# EAGLE design tetrabyte-slim (EAGLE 7.7.0)
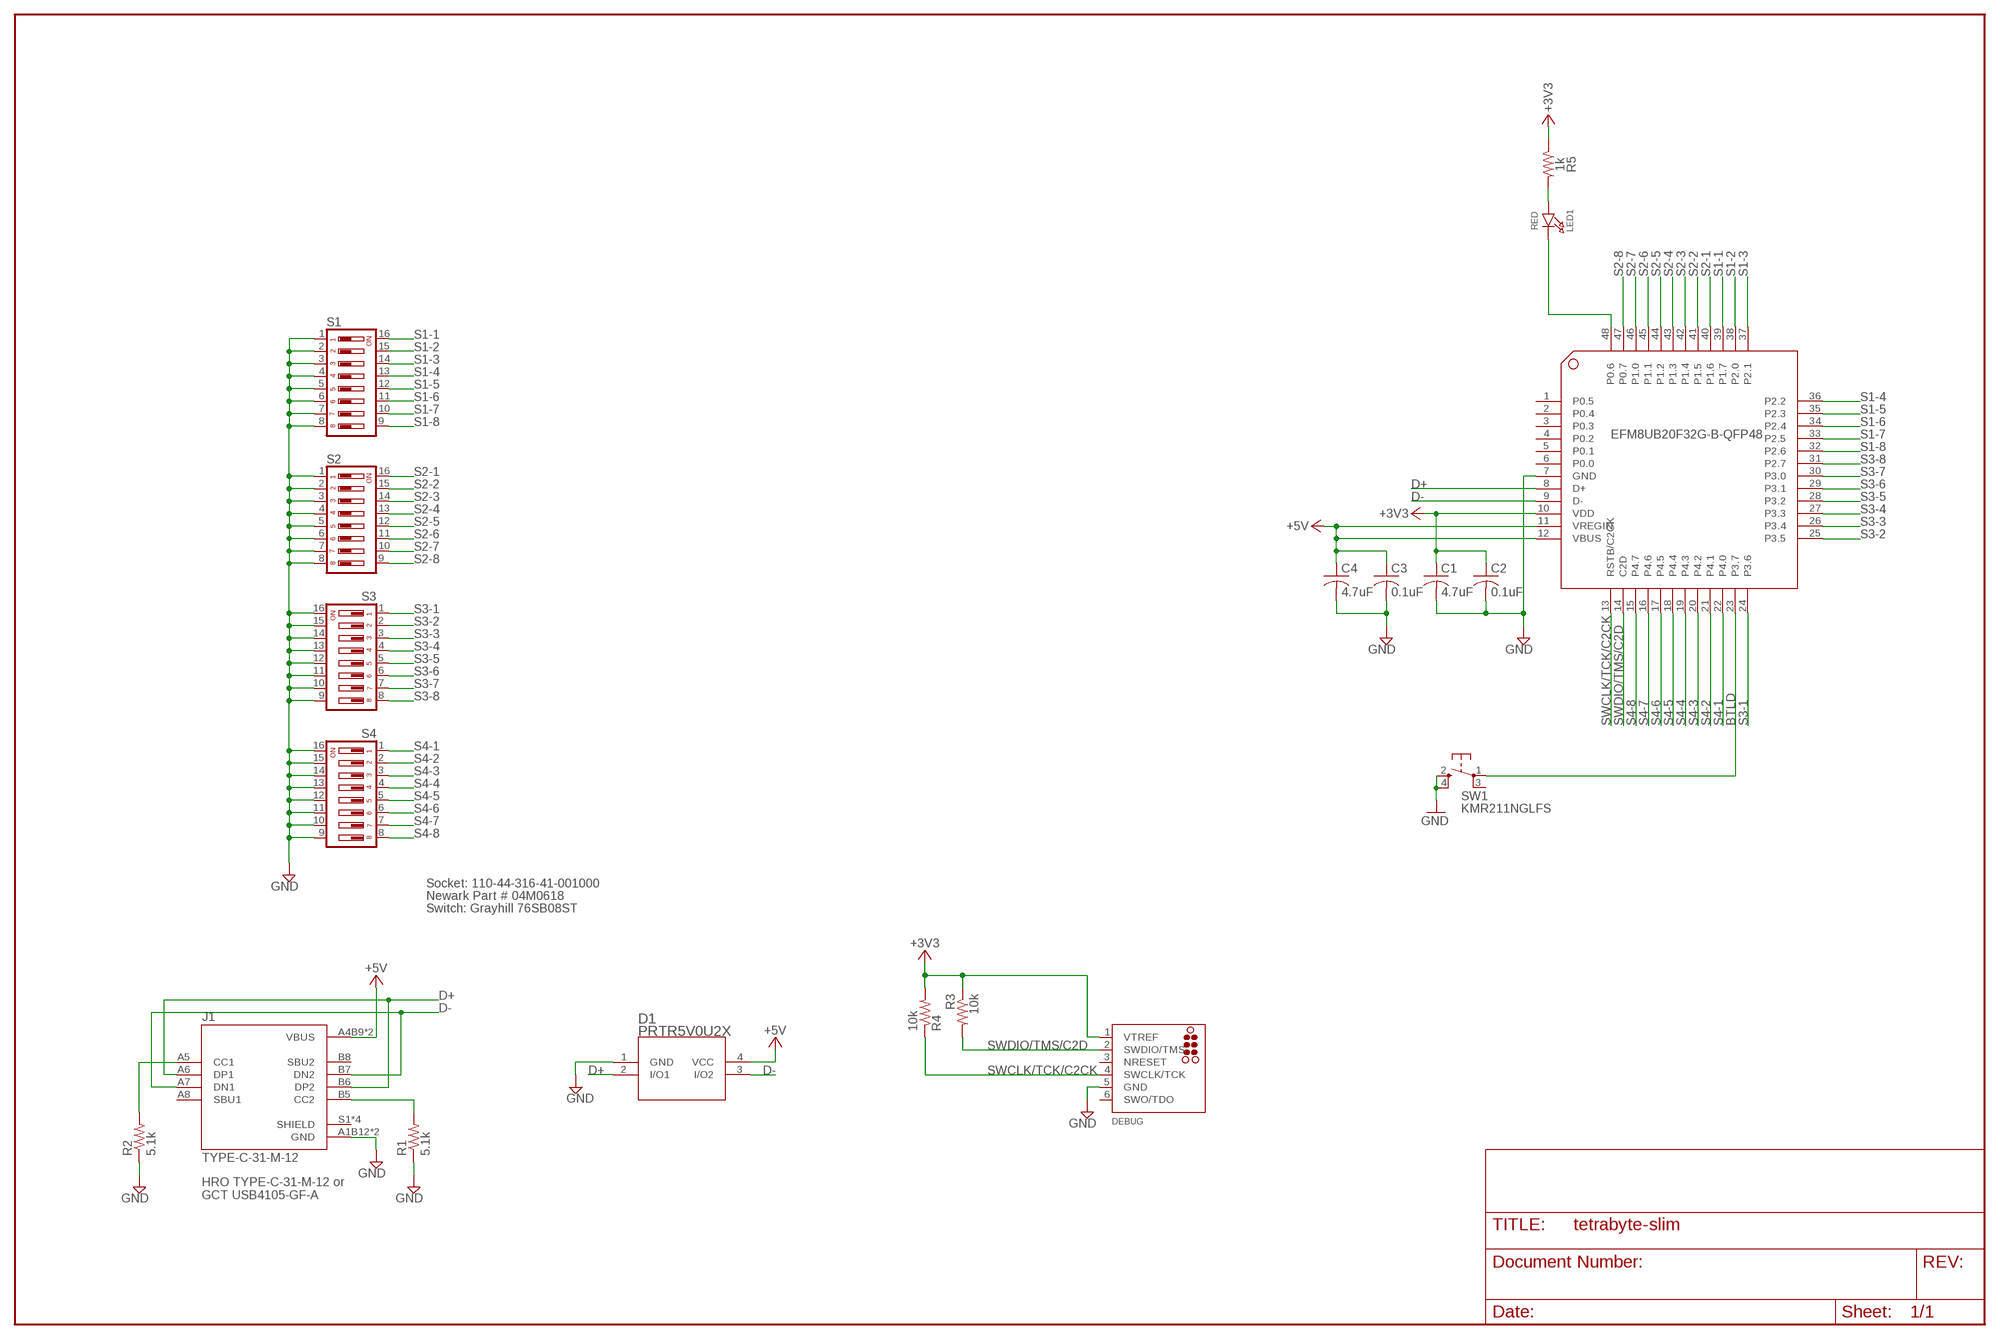
[diagram p0: schematic, sheet 1]

## Parts
C1  4.7uF  C-USC0603K  [C0603K]
C2  0.1uF  C-USC0603K  [C0603K]
C3  0.1uF  C-USC0603K  [C0603K]
C4  4.7uF  C-USC0603K  [C0603K]
D1  PRTR5V0U2X  [SOT143B]
DEBUG  TC2030-CTX-SWD  [TC2030-MCP-NL]
J1  TYPE-C-31-M-12  [HRO_TYPE-C-31-M-12]
LED1  RED  LED0805_NOOUTLINE  [CHIPLED_0805_NOOUTLINE]
R1  5.1k  R-US_R0603  [R0603]
R2  5.1k  R-US_R0603  [R0603]
R3  10k  R-US_R0603  [R0603]
R4  10k  R-US_R0603  [R0603]
R5  1k  R-US_R0603  [R0603]
S1  DS08  [DS-08]
S2  DS08  [DS-08]
S3  DS08  [DS-08]
S4  DS08  [DS-08]
SW1  KMR211NGLFS  SPST_TACT-KMR2  [KMR2]
U1  EFM8UB20F64G-B-QFP48  [EFM8UB2-QFP48]

## Nets
+3V3: C1.1 C2.1 DEBUG.1(VTREF) R3.1 R4.2 R5.1 U1.10(VDD)
+5V: C3.1 C4.1 D1.4(VCC) J1.A4B9(VBUS) J1.B4A9(VBUS) U1.11(VREGIN) U1.12(VBUS)
BTLD: SW1.1(P) U1.23(P3.7)
D+: D1.2(I/O1) J1.A6(DP1) J1.B6(DP2) U1.8(D+)
D-: D1.3(I/O2) J1.A7(DN1) J1.B7(DN2) U1.9(D-)
GND: C1.2 C2.2 C3.2 C4.2 D1.1(GND) DEBUG.5(GND) J1.A1B12(GND) J1.B1A12(GND) R1.1 R2.1 S1.1 S1.2 S1.3 S1.4 S1.5 S1.6 S1.7 S1.8 S2.1 S2.2 S2.3 S2.4 S2.5 S2.6 S2.7 S2.8 S3.9 S3.10 S3.11 S3.12 S3.13 S3.14 S3.15 S3.16 S4.9 S4.10 S4.11 S4.12 S4.13 S4.14 S4.15 S4.16 SW1.2(S) SW1.4(S1) U1.7(GND)
N$3: LED1.A R5.2
N$19: LED1.C U1.48(P0.6)
N$20: J1.B5(CC2) R1.2
N$21: J1.A5(CC1) R2.2
S1-1: S1.16 U1.39(P1.7)
S1-2: S1.15 U1.38(P2.0)
S1-3: S1.14 U1.37(P2.1)
S1-4: S1.13 U1.36(P2.2)
S1-5: S1.12 U1.35(P2.3)
S1-6: S1.11 U1.34(P2.4)
S1-7: S1.10 U1.33(P2.5)
S1-8: S1.9 U1.32(P2.6)
S2-1: S2.16 U1.40(P1.6)
S2-2: S2.15 U1.41(P1.5)
S2-3: S2.14 U1.42(P1.4)
S2-4: S2.13 U1.43(P1.3)
S2-5: S2.12 U1.44(P1.2)
S2-6: S2.11 U1.45(P1.1)
S2-7: S2.10 U1.46(P1.0)
S2-8: S2.9 U1.47(P0.7)
S3-1: S3.1 U1.24(P3.6)
S3-2: S3.2 U1.25(P3.5)
S3-3: S3.3 U1.26(P3.4)
S3-4: S3.4 U1.27(P3.3)
S3-5: S3.5 U1.28(P3.2)
S3-6: S3.6 U1.29(P3.1)
S3-7: S3.7 U1.30(P3.0)
S3-8: S3.8 U1.31(P2.7)
S4-1: S4.1 U1.22(P4.0)
S4-2: S4.2 U1.21(P4.1)
S4-3: S4.3 U1.20(P4.2)
S4-4: S4.4 U1.19(P4.3)
S4-5: S4.5 U1.18(P4.4)
S4-6: S4.6 U1.17(P4.5)
S4-7: S4.7 U1.16(P4.6)
S4-8: S4.8 U1.15(P4.7)
SWCLK/TCK/C2CK: DEBUG.4(SWCLK/TCK) R4.1 U1.13(RSTB/C2CK)
SWDIO/TMS/C2D: DEBUG.2(SWDIO/TMS) R3.2 U1.14(C2D)
Unconnected: DEBUG.6(SWO/TDO) J1.A8(SBU1) J1.B8(SBU2) J1.S1(SHIELD) J1.S2(SHIELD) J1.S3(SHIELD) J1.S4(SHIELD) SW1.3(P1) U1.1(P0.5) U1.2(P0.4) U1.3(P0.3) U1.4(P0.2) U1.5(P0.1) U1.6(P0.0)

## Notes on the sheet
- EFM8UB20F32G-B-QFP48
- Socket: 110-44-316-41-001000
- Newark Part # 04M0618
- Switch: Grayhill 76SB08ST
- HRO TYPE-C-31-M-12 or
  GCT USB4105-GF-A

## Power pins joined to a net without a drawn wire
NRESET: DEBUG.3(NRESET)

## Library data of the parts
C1-C4 = rcl:C-US: CAPACITOR, American symbol
D1 = Nexperia_PRTR5V0U2X,215:PRTR5V0U2X; MANUFACTURER_PART_NUMBER: PRTR5V0U2X; VENDOR: NXP
DEBUG = tag-connect:TC2030-CTX-SWD
J1 = TYPE-C-31-M-12-OSHPARK:TYPE-C-31-M-12: USB Connectors 24 Receptacle 1 8.94*7.3mm RoHS; AVAILABILITY: Unavailable; DESCRIPTION: USB Connectors 24 Receptacle 1 8.94*7.3mm RoHS; MF: HRO Electronics Co., Ltd.; MP: TYPE-C-31-M-12; PACKAGE: Package; PRICE: None
LED1 = microbuilder:LED: LED 0603 - 0603 Surface Mount Package 2mA: Green LED - Low Power (3.9mcd, 2ma, 1.7Vf) - Digikey: 475-2709-2-ND Orange LED - Low Power (9.8mcd, 2ma, 1.8Vf) - Digikey: 475-1194-2-ND Red LED - Low Power (5mcd, 2ma, 1.8Vf) - Digikey: 475-1195-2-ND Yellow LED - Low Power (7mcd, 2ma, 1.8Vf) - Digikey: 475-1196-2-ND 5mA: Blue LED - Low Power (17mcd, 5ma, 2.9Vf) - Digikey: LNJ937W8CRACT-ND 0805 - 0805 Surface Mount Package 2mA: Red LED (8.8mcd, 2mA, 1.8Vf, Clear) - Low Power [Digikey: 475-2510-1-ND] Green LED (5mcd, 2mA, 1.8Vf, Clear) - Low Power [Digikey: 475-2730-1-ND] Yellow LED (11.3mcd, 2mA, 1.8Vf, Clear) - Low Power [Digikey: 475-2555-1-ND] 20mA: Red LED (104mcd, 20mA, Diffused) - LS R976 [Digikey: 475-1278-6-ND] Red LED (12mcd, 20mA, 2.0Vf, Clear) - APT2012EC [Digikey: 754-1128-1-ND] Green LED (15mcd, 20mA, 2.2Vf, Clear) - APT2012GC [Digikey: 754-1131-1-ND] Orange LED (160mcd, 20mA, 2.1Vf, Clear) - APT2012SECK [Digikey: 754-1130-1-ND] 1206 - 1206 Surface Mount Package Green LED (26mcd, 20mA, Diffused) - LG N971 [Digikey: 475-1407-6-ND] Red LED (15mcd, 20mA, Diffused) - LH N974 [Digikey: 475-1416-6-ND] Cree - Cree High-Power Surface Mount LEDs XPEBWT-L1-0000-00D50 - White 111lm 350mA 2.9Vf 6200K 110° XTEAWT-00-0000-00000LEE3 - White 114lm 350mA 2.85Vf 5000K 115° Everlight - Everlight 45-21 Series Surface Mount LEDs 45-21/QK2C-B2832AC2CB2/2T - Warm White 2000mcd 20mA 3.25Vf 3050K 120° 45-21/LK2C-B38452C4CB2/2T - Nuetral White 2000mcd 20mA 3.25Vf 4150K 120° 45-21/LK2C-B50634C6CB2/2T - Cold White 2200mcd 20mA 3.25Vf 5650K 120° PLCC2 Reverse Mount LS T77K-J1L2-1-0-2-R18-Z - Red 11.25mcd 2mA 1.8Vf 630nm 120° LO T77K-L1M2-24-Z - Orange 19.6mcd 2mA 1.8Vf 606nm 120° LY T77K-K2M1-26-Z - Yellow 15.7mcd 2mA 1.8Vf 587nm 120°
R1-R5 = rcl:R-US_: RESISTOR, American symbol
S1-S4 = switch-dil:DS08: DIL/CODE SWITCH; MPN: DS08; OC_FARNELL: unknown; OC_NEWARK: 73J0071
SW1 = adafruit:SPST_TACT: SMT 6mm switch, EVQQ2 series http://www.ladyada.net/library/eagle
U1 = Glen-EFM8UB2:EFM8UB20F64G-B-QFP48

## Board
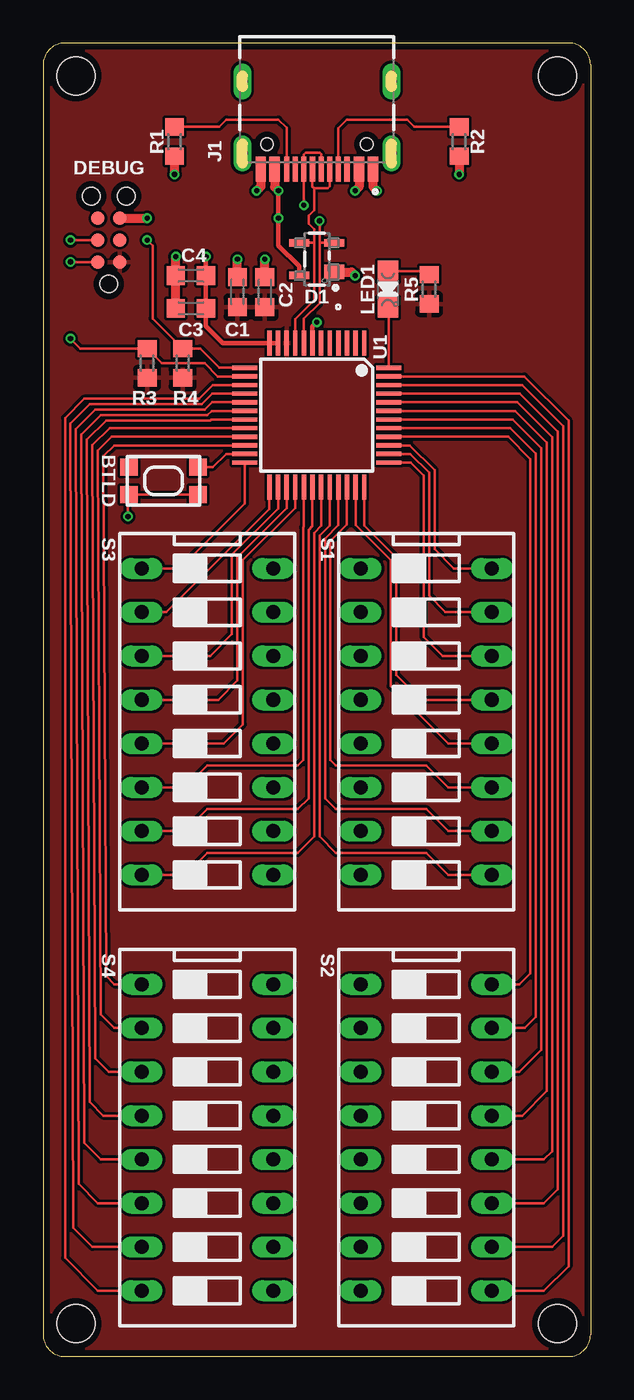
[diagram p1: board, top side]
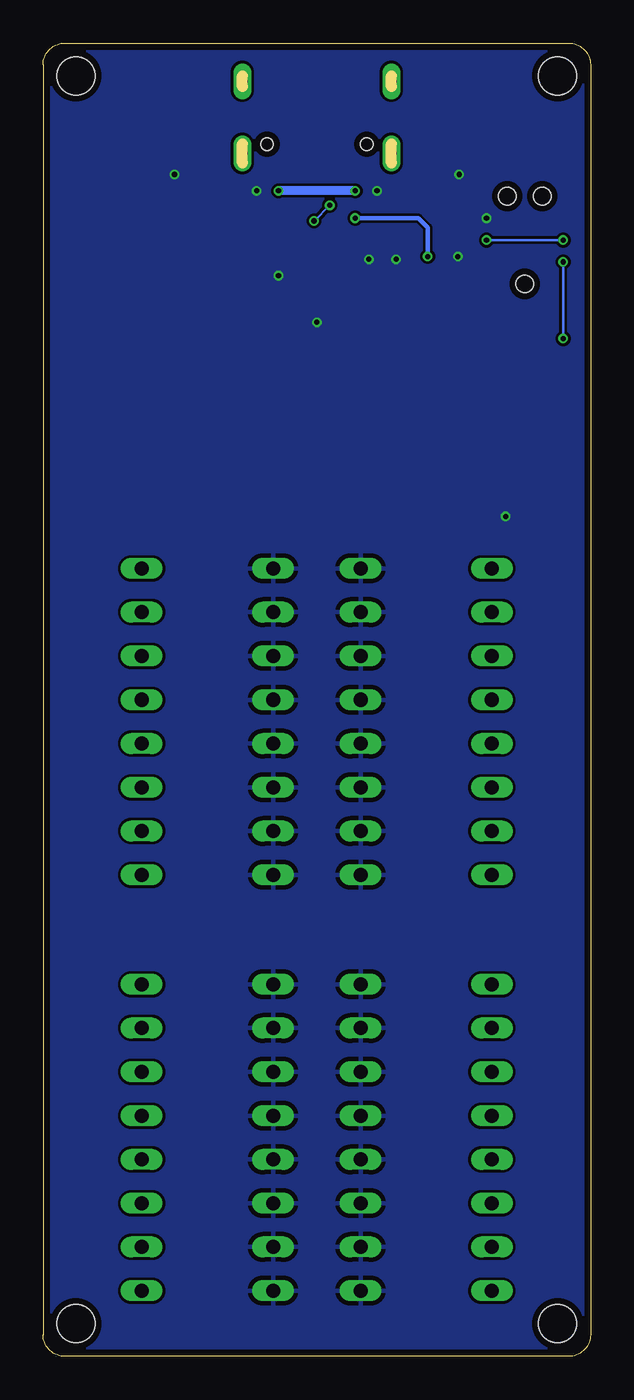
[diagram p2: board, bottom side, seen from below]

Size 31.75 x 76.2 mm. Coordinates in mm from the lower left corner, seen from the top.
Outline: 30.48,0 arc90 31.75,1.27 31.75,74.93 arc90 30.48,76.2 1.27,76.2 arc90 0,74.93 0,1.27 arc90 1.27,0 30.48,0
Copper layers (1*16): Top 0.035559375mm / dielectric 1.6mm / Bottom 0.035559375mm
Design rules "oshpark-2layer-2018": minimum track width 6mil, minimum drill 10mil, track to track 6mil, track to pad 6mil, pad to pad 6mil, via to via 6mil, smd to smd 6mil, copper to edge 15mil, drill to drill 6mil, minimum pad ring 5mil, minimum via ring 5mil, stop-mask expansion 2.5mil, vias tented up to drill 0mil, thermal gap 10mil
Holes 2.2 mm at 1.91,74.3 29.84,74.3 1.91,1.91 29.84,1.91

### Footprints (pad centres in the part's own frame; a part is rotated, then mirrored left to right if it is on the bottom)
C0603K = smd 1.05 x 1.08: 1 -0.875,0; 2 0.875,0
SOT143B = smd 0.838 x 1.168: 1 -0.747,-1.016 | smd 0.432 x 1.168: 2 0.95,-1.016; 3 0.95,1.016; 4 -0.95,1.016
TC2030-MCP-NL = smd 0.787 x 0.787: 1 1.27,-0.635; 2 1.27,0.635; 3 2.54,-0.635; 4 2.54,0.635; 5 3.81,-0.635; 6 3.81,0.635 | hole 0.991: 0,0; 5.08,-1.016; 5.08,1.016
HRO_TYPE-C-31-M-12 = smd 0.6 x 1.45: A1B12 -3.25,5.095; A4B9 -2.45,5.095; B1A12 3.25,5.095; B4A9 2.45,5.095 | smd 0.3 x 1.45: A5 -1.25,5.095; A6 -0.25,5.095; A7 0.25,5.095; A8 1.25,5.095; B5 1.75,5.095; B6 0.75,5.095; B7 -0.75,5.095; B8 -1.75,5.095 | drill 0.65 pad 1.05 long: S1 -4.32,4.18; S2 4.32,4.18; S3 -4.32,0; S4 4.32,0 | hole 0.7: -2.89,3.65; 2.89,3.65
CHIPLED_0805_NOOUTLINE = smd 1.2 x 1.2: A 0,-1.05; C 0,1.05
R0603 = smd 1 x 1.1: 1 -0.85,0; 2 0.85,0
DS-08 = drill 0.813 long: 1 -8.89,-3.81; 2 -6.35,-3.81; 3 -3.81,-3.81; 4 -1.27,-3.81; 5 1.27,-3.81; 6 3.81,-3.81; 7 6.35,-3.81; 8 8.89,-3.81; 9 8.89,3.81; 10 6.35,3.81; 11 3.81,3.81; 12 1.27,3.81; 13 -1.27,3.81; 14 -3.81,3.81; 15 -6.35,3.81; 16 -8.89,3.81
KMR2 = smd 1 x 1: 1 2,0.8; 2 2,-0.8; 3 -2,0.8; 4 -2,-0.8
EFM8UB2-QFP48 = smd 1.45 x 0.25: 1 -4.175,2.75; 2 -4.175,2.25; 3 -4.175,1.75; 4 -4.175,1.25; 5 -4.175,0.75; 6 -4.175,0.25; 7 -4.175,-0.25; 8 -4.175,-0.75; 9 -4.175,-1.25; 10 -4.175,-1.75; 11 -4.175,-2.25; 12 -4.175,-2.75; 25 4.175,-2.75; 26 4.175,-2.25; 27 4.175,-1.75; 28 4.175,-1.25; 29 4.175,-0.75; 30 4.175,-0.25; 31 4.175,0.25; 32 4.175,0.75; 33 4.175,1.25; 34 4.175,1.75; 35 4.175,2.25; 36 4.175,2.75 | smd 0.25 x 1.45: 13 -2.75,-4.175; 14 -2.25,-4.175; 15 -1.75,-4.175; 16 -1.25,-4.175; 17 -0.75,-4.175; 18 -0.25,-4.175; 19 0.25,-4.175; 20 0.75,-4.175; 21 1.25,-4.175; 22 1.75,-4.175; 23 2.25,-4.175; 24 2.75,-4.175; 37 2.75,4.175; 38 2.25,4.175; 39 1.75,4.175; 40 1.25,4.175; 41 0.75,4.175; 42 0.25,4.175; 43 -0.25,4.175; 44 -0.75,4.175; 45 -1.25,4.175; 46 -1.75,4.175; 47 -2.25,4.175; 48 -2.75,4.175

### Placement (x,y rotation side)
C1  11.27,61.75 90 top
C2  12.86,61.75 90 top
C3  8.57,60.8 180 top
C4  8.57,62.71 180 top
D1  15.88,63.66 90 top
DEBUG  3.81,62.23 90 top
J1  15.88,73.98 180 top
LED1  20,61.91 180 top
R1  7.62,70.48 90 top
R2  24.13,70.48 90 top
R3  6.03,57.63 90 top
R4  8.1,57.63 270 top
R5  22.38,61.91 90 top
S1  22.23,36.83 270 top
S2  22.23,12.7 270 top
S3  9.53,36.83 270 top
S4  9.53,12.7 270 top
SW1  6.99,50.8 0 top
U1  15.88,54.61 270 top

### Tracks (layer width: path | path; a pad name or v marks a point on that pad's centre or on a via)
+3V3
  pour Top (isolate 0.152): 31.75,0 0,0 0,76.2 31.75,76.2
+5V  (via drill 0.3)
  Top 0.254: D1.4 14.86,63.25 13.65,64.45 v13.65,66.04 v13.65,67.63 | v9.45,63.82 C4.1 C3.1 9.45,59.77 10.43,58.78 U1.12 U1.11
  Top 0.508: J1.B4A9 13.43,67.86 v13.65,67.63 | J1.A4B9 18.32,67.86 v18.1,67.63
  Bottom 0.254: v13.65,66.04 10,66.04 9.45,65.49 v9.45,63.82
  Bottom 0.508: v13.65,67.63 v18.1,67.63
BTLD
  Top 0.152: SW1.1 9.85,51.6 10.61,52.36 U1.23
D+  (via drill 0.3)
  Top 0.152: U1.8 15.12,60.21 16.03,61.12 16.03,64.61 | J1.A6 16.12,69.76 16.03,69.85 15.24,69.85 15.12,69.73 J1.B6 v15.12,66.79 | 16.04,64.77 16.03,64.61 | v16.03,65.88 16.03,64.61 | D1.2 16.03,64.61
  Bottom 0.152: v15.12,66.79 v16.03,65.88
D-
  Top 0.152: U1.9 14.62,60.19 15.72,61.28 15.72,64.61 | D1.3 15.55,64.61 15.72,64.61 | J1.B7 16.62,67.9 16.51,67.79 15.72,67.79 | J1.A7 15.62,67.88 15.72,67.79 | 15.72,64.61 15.72,65.41 15.4,65.72 15.4,66.2 15.72,66.52 15.72,67.79
GND  (via drill 0.3)
  Top 0.152: SW1.2 SW1.4 4.92,49.94 v4.92,48.74
  Top 0.254: U1.7 15.62,59.76 v15.88,60.01
  Top 0.508: R1.1 v7.62,68.58 | R2.1 v24.13,68.58 | D1.1 17.89,62.91 v18.1,62.71 | C3.2 C4.2 v7.7,63.82 | C1.2 v11.27,63.66 | C2.2 v12.86,63.66 | J1.B1A12 12.62,67.87 v12.38,67.63 | J1.A1B12 19.12,67.87 v19.37,67.63 | DEBUG.5 v6.03,66.04
  pour Bottom (isolate 0.152): 31.75,0 0,0 0,76.2 31.75,76.2
N$3
  Top 0.152: LED1.A 22.18,62.96 R5.2
N$19
  Top 0.152: U1.48 20.05,60.81 LED1.C
N$20
  Top 0.152: J1.B5 14.13,71.28 13.65,71.75 10.64,71.75 10.22,71.33 R1.2
N$21
  Top 0.152: J1.A5 17.12,71.26 17.62,71.75 21.11,71.75 21.53,71.33 R2.2
S1-1
  Top 0.152: S1.16 23.81,45.72 22.7,46.83 22.7,51.44 21.28,52.86 U1.39
S1-2
  Top 0.152: S1.15 23.34,43.18 22.38,44.13 22.38,51.28 21.3,52.36 U1.38
S1-3
  Top 0.152: S1.14 23.18,40.64 22.07,41.75 22.07,51.12 21.32,51.86 U1.37
S1-4
  Top 0.152: S1.13 21.91,38.1 20.48,39.53 20.48,46.35 18.62,48.21 U1.36
S1-5
  Top 0.152: U1.35 18.12,48.23 20.16,46.2 20.16,38.89 23.5,35.56 S1.12
S1-6
  Top 0.152: S1.11 23.5,33.02 22.23,34.29 16.99,34.29 16.67,34.61 16.67,47.31 17.62,48.26 U1.34
S1-7
  Top 0.152: S1.10 23.5,30.48 22.23,31.75 16.99,31.75 16.35,32.38 16.35,47.47 17.12,48.24 U1.33
S1-8
  Top 0.152: S1.9 23.5,27.94 22.23,29.21 16.99,29.21 16.03,30.16 16.03,47.62 16.62,48.22 U1.32
S2-1
  Top 0.152: U1.40 26.97,53.36 28.26,52.07 28.26,22.23 27.62,21.59 S2.16
S2-2
  Top 0.152: U1.41 27.1,53.86 28.57,52.39 28.57,19.68 27.94,19.05 S2.15
S2-3
  Top 0.152: U1.42 27.24,54.36 28.89,52.7 28.89,17.78 27.62,16.51 S2.14
S2-4
  Top 0.152: U1.43 27.37,54.86 29.21,53.02 29.21,15.4 27.78,13.97 S2.13
S2-5
  Top 0.152: U1.44 27.51,55.36 29.53,53.34 29.53,11.91 29.05,11.43 S2.12
S2-6
  Top 0.152: U1.45 27.64,55.86 29.84,53.66 29.84,9.68 29.05,8.89 S2.11
S2-7
  Top 0.152: U1.46 27.78,56.36 30.16,53.98 30.16,6.99 29.53,6.35 S2.10
S2-8
  Top 0.152: U1.47 27.91,56.86 30.48,54.29 30.48,5.24 29.05,3.81 S2.9
S3-1
  Top 0.152: S3.1 7.94,45.72 11.7,49.48 U1.24
S3-2
  Top 0.152: S3.2 7.14,43.18 13.12,49.16 U1.25
S3-3
  Top 0.152: S3.3 9.68,40.64 10.95,41.91 10.95,46.51 13.62,49.19 U1.26
S3-4
  Top 0.152: U1.27 14.12,49.21 11.27,46.35 11.27,39.21 10.16,38.1 S3.4
S3-5
  Top 0.152: S3.5 10.48,35.56 11.59,36.67 11.59,46.2 14.62,49.23 U1.28
S3-6
  Top 0.152: S3.6 8.26,33.02 9.53,34.29 14.76,34.29 15.08,34.61 15.08,48.1 15.12,48.15 U1.29
S3-7
  Top 0.152: S3.7 8.26,30.48 9.53,31.75 14.76,31.75 15.4,32.38 15.4,47.94 15.62,48.17 U1.30
S3-8
  Top 0.152: S3.8 8.26,27.94 9.53,29.21 14.76,29.21 15.72,30.16 15.72,47.78 16.12,48.19 U1.31
S4-1
  Top 0.152: U1.22 4.12,52.86 3.49,52.23 3.65,22.07 4.13,21.59 S4.1
S4-2
  Top 0.152: U1.21 3.99,53.36 3.17,52.55 3.33,19.84 4.13,19.05 S4.2
S4-3
  Top 0.152: U1.20 3.85,53.86 2.86,52.86 3.02,17.3 3.81,16.51 S4.3
S4-4
  Top 0.152: U1.19 9.75,54.36 9.68,54.29 3.65,54.29 2.54,53.18 2.7,14.76 3.49,13.97 S4.4
S4-5
  Top 0.152: U1.18 9.78,54.86 9.53,54.61 3.33,54.61 2.22,53.5 2.38,12.38 3.33,11.43 S4.5
S4-6
  Top 0.152: U1.17 9.8,55.36 9.37,54.93 3.02,54.93 1.91,53.82 2.06,10 3.17,8.89 S4.6
S4-7
  Top 0.152: U1.16 9.82,55.86 9.21,55.24 2.7,55.24 1.59,54.13 1.75,7.46 2.86,6.35 S4.7
S4-8
  Top 0.152: U1.15 9.85,56.36 9.05,55.56 2.38,55.56 1.27,54.45 1.27,5.71 3.17,3.81 S4.8
SWCLK/TCK/C2CK  (via drill 0.3)
  Top 0.152: DEBUG.4 v1.59,64.77 | U1.13 10.22,57.36 9.11,58.48 R4.1 6.35,60.22 6.35,64.45 v6.03,64.77
  Bottom 0.152: v1.59,64.77 v6.03,64.77
SWDIO/TMS/C2D  (via drill 0.3)
  Top 0.152: DEBUG.2 v1.59,63.5 | U1.14 10.13,56.86 9.37,57.63 6.88,57.63 R3.2 2.17,58.48 v1.59,59.05
  Bottom 0.152: v1.59,59.05 v1.59,63.5

### Text on the board
_tsilk: R1 | R2 | DEBUG | J1 | C4 | C2 | D1 | LED1 | R5 | C3 | C1 | U1 | R3 | R4 | BTLD | S3 | S1 | S4 | S2